# Altium schematic sheet ESP32 USBC.SchDoc
size A2; SheetNumber: 1; SheetTotal: 1
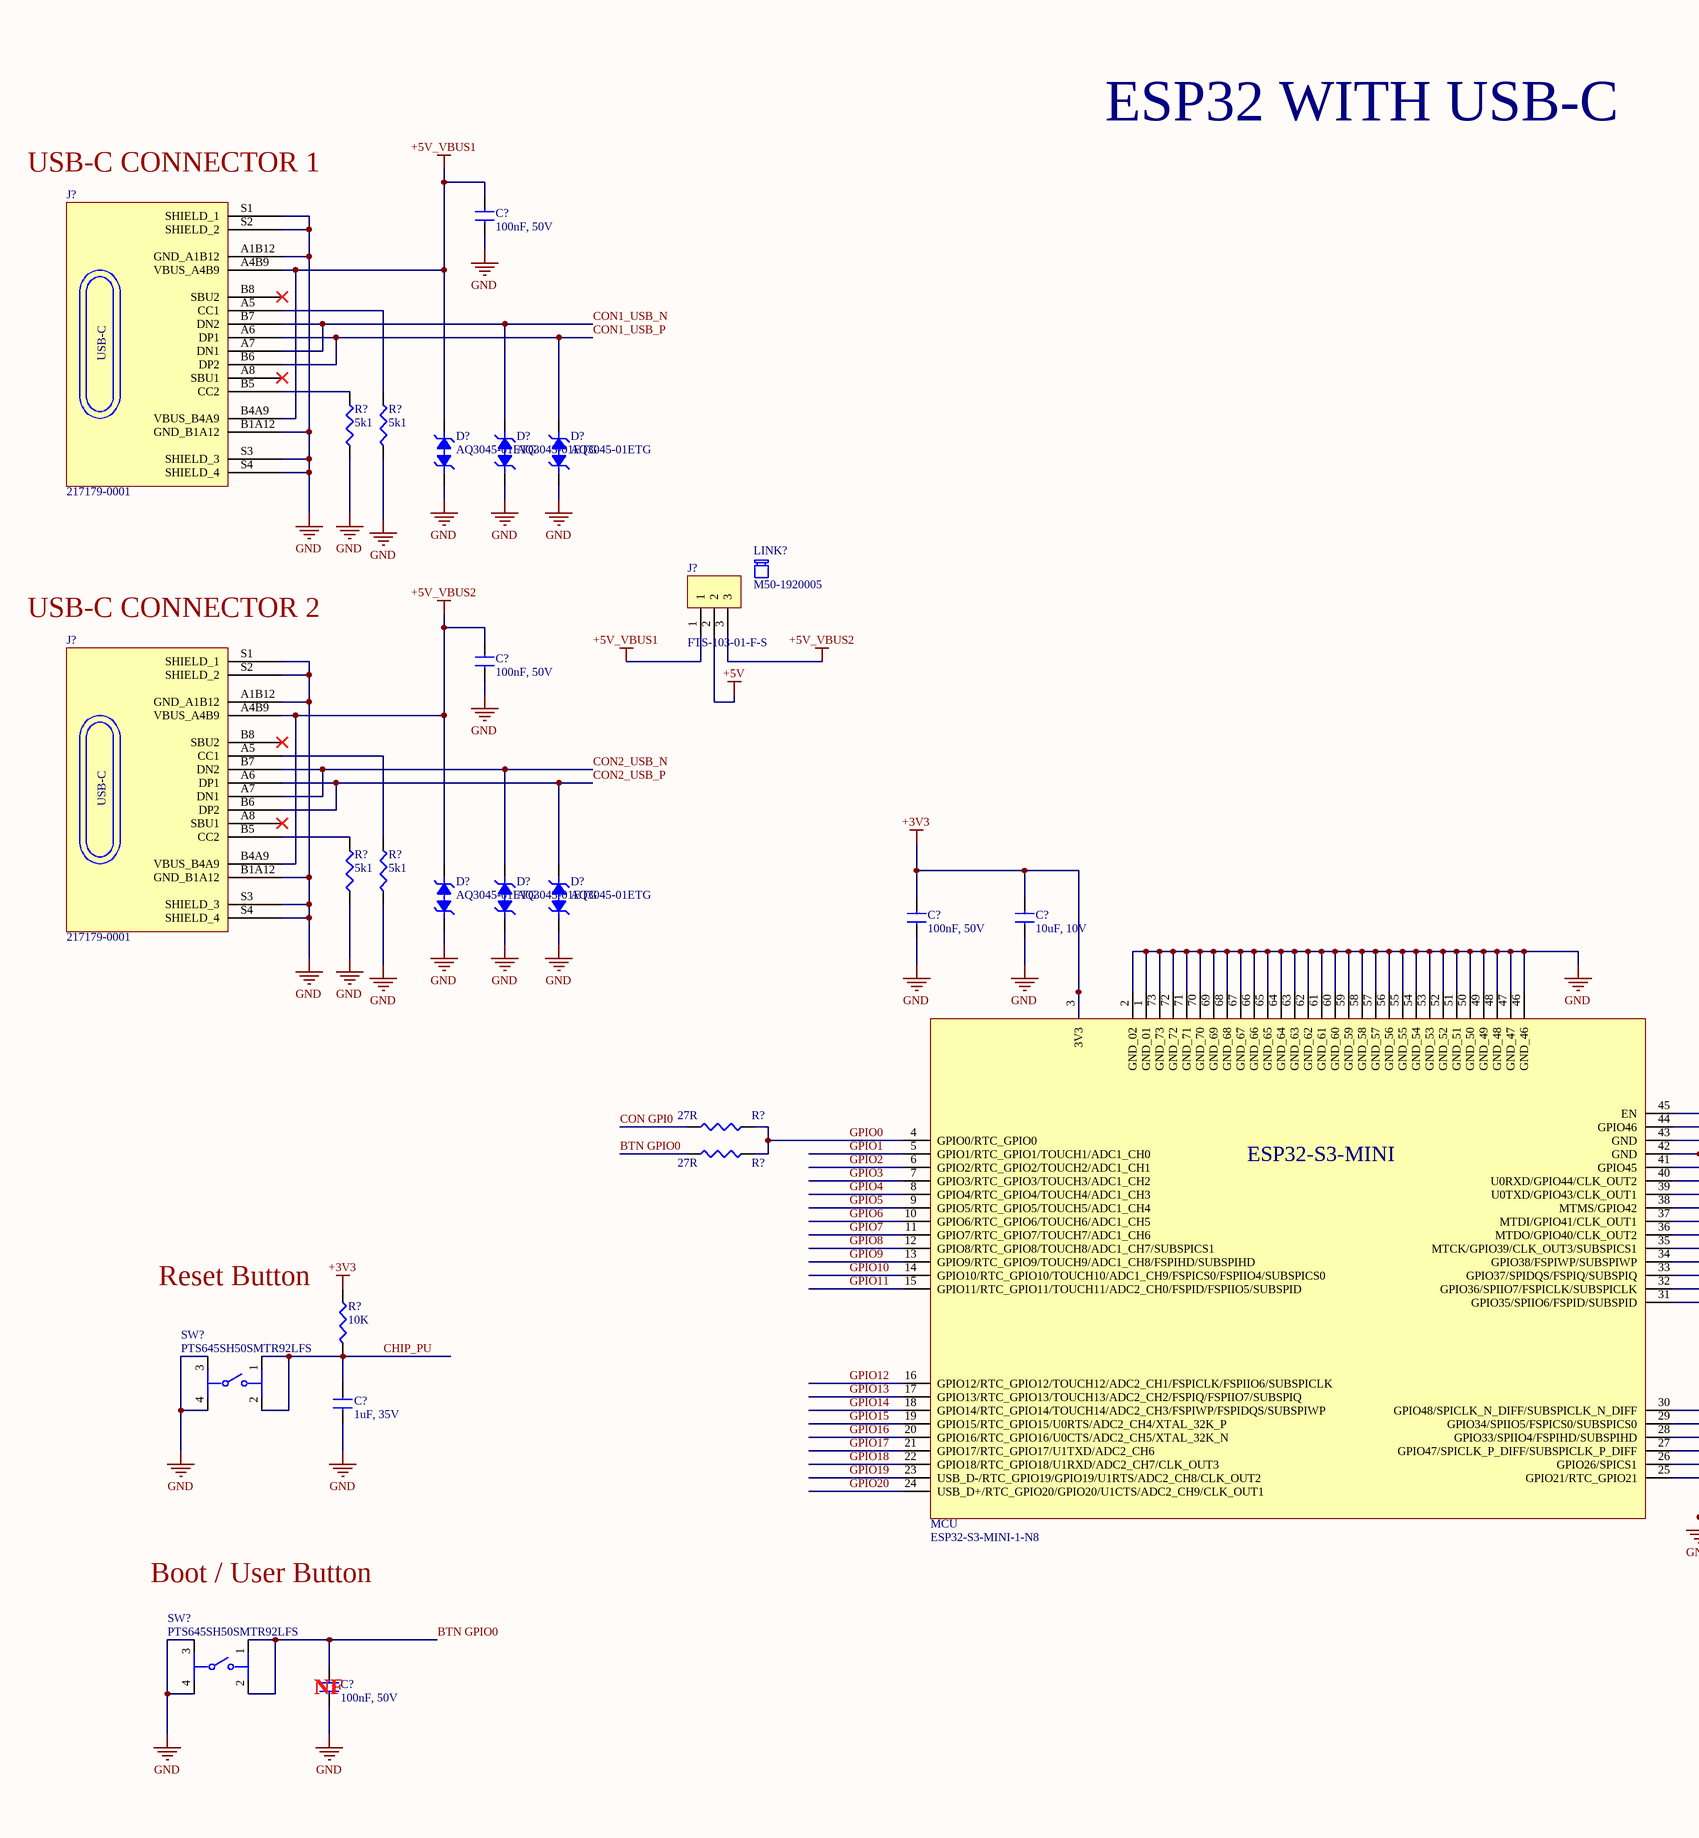
[diagram p0: ESP32 USBC.SchDoc, left]
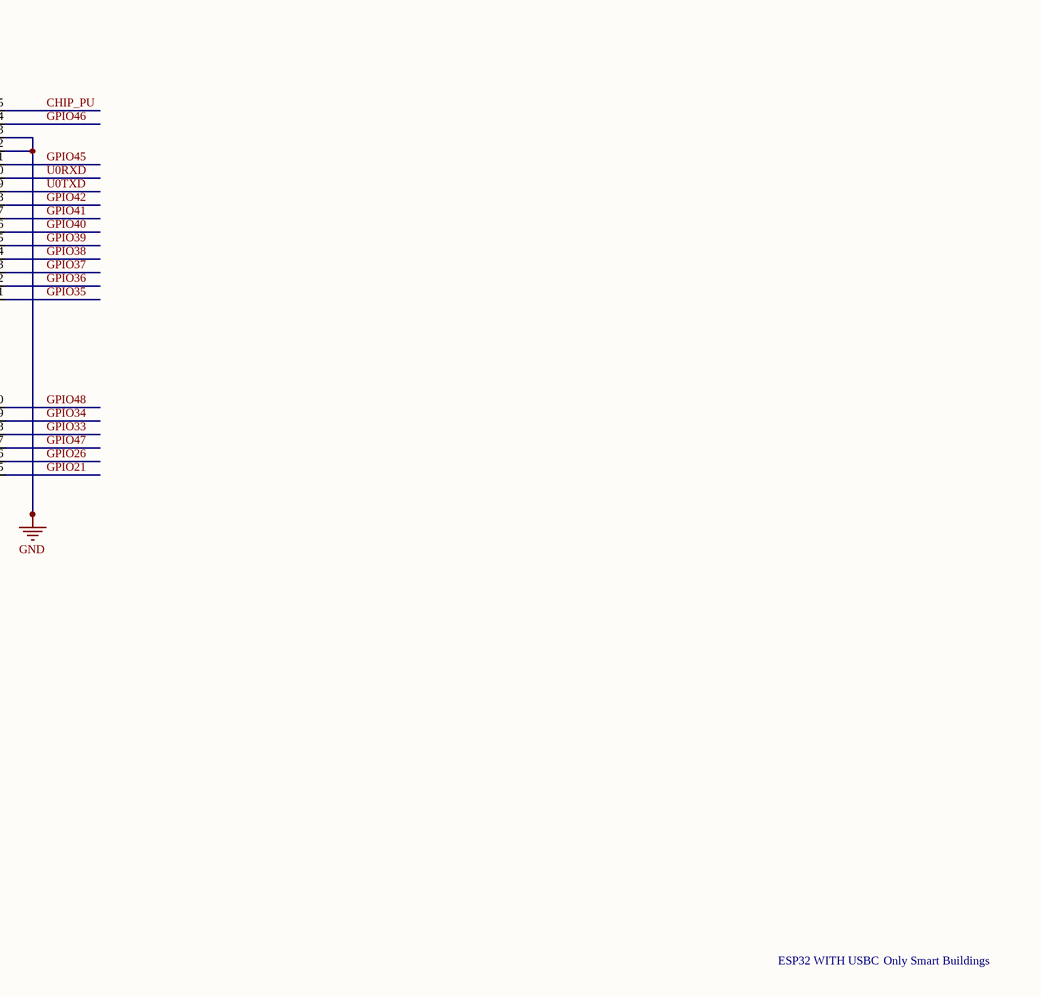
[diagram p1: ESP32 USBC.SchDoc, right]

## Parts
(Parts that share a designator on the sheet are numbered #1, #2 ... from top to bottom, then left to right.)
C?#1  100nF, 50V
C?#2  100nF, 50V
C?#3  100nF, 50V
C?#4  10uF, 10V
C?#5  1uF, 35V
C?#6  100nF, 50V
D?#1  AQ3045-01ETG
D?#2  AQ3045-01ETG
D?#3  AQ3045-01ETG
D?#4  AQ3045-01ETG
D?#5  AQ3045-01ETG
D?#6  AQ3045-01ETG
J?#1  217179-0001
J?#2  FTS-103-01-F-S
J?#3  217179-0001
LINK?  M50-1920005
MCU  ESP32-S3-MINI-1-N8
R?#1  5k1
R?#2  5k1
R?#3  5k1
R?#4  5k1
R?#5  27R
R?#6  27R
R?#7  10K
SW?#1  PTS645SH50SMTR92LFS
SW?#2  PTS645SH50SMTR92LFS

## Nets
+3V3: C?#3.2 C?#4.2 MCU.3(3V3) R?#7.1
+5V: J?#2.2
+5V_VBUS1: C?#1.2 D?#1.2 J?#1.A4B9(VBUS_A4B9) J?#1.B4A9(VBUS_B4A9) J?#2.1
+5V_VBUS2: C?#2.2 D?#4.2 J?#2.3 J?#3.A4B9(VBUS_A4B9) J?#3.B4A9(VBUS_B4A9)
GND: C?#1.1 C?#2.1 C?#3.1 C?#4.1 C?#5.1 C?#6.1 D?#1.1 D?#2.1 D?#3.1 D?#4.1 D?#5.1 D?#6.1 J?#1.A1B12(GND_A1B12) J?#1.B1A12(GND_B1A12) J?#1.S1(SHIELD_1) J?#1.S2(SHIELD_2) J?#1.S3(SHIELD_3) J?#1.S4(SHIELD_4) J?#3.A1B12(GND_A1B12) J?#3.B1A12(GND_B1A12) J?#3.S1(SHIELD_1) J?#3.S2(SHIELD_2) J?#3.S3(SHIELD_3) J?#3.S4(SHIELD_4) MCU.1(GND_01) MCU.2(GND_02) MCU.42(GND) MCU.43(GND) MCU.46(GND_46) MCU.47(GND_47) MCU.48(GND_48) MCU.49(GND_49) MCU.50(GND_50) MCU.51(GND_51) MCU.52(GND_52) MCU.53(GND_53) MCU.54(GND_54) MCU.55(GND_55) MCU.56(GND_56) MCU.57(GND_57) MCU.58(GND_58) MCU.59(GND_59) MCU.60(GND_60) MCU.61(GND_61) MCU.62(GND_62) MCU.63(GND_63) MCU.64(GND_64) MCU.65(GND_65) MCU.66(GND_66) MCU.67(GND_67) MCU.68(GND_68) MCU.69(GND_69) MCU.70(GND_70) MCU.71(GND_71) MCU.72(GND_72) MCU.73(GND_73) R?#1.2 R?#2.1 R?#3.2 R?#4.1 SW?#1.3 SW?#1.4 SW?#2.3 SW?#2.4
BTN GPIO0: C?#6.2 R?#6.1 SW?#2.1 SW?#2.2
CHIP_PU: C?#5.2 MCU.45(EN) R?#7.2 SW?#1.1 SW?#1.2
CON1_USB_N: D?#2.2 J?#1.A7(DN1) J?#1.B7(DN2)
CON1_USB_P: D?#3.2 J?#1.A6(DP1) J?#1.B6(DP2)
CON2_USB_N: D?#5.2 J?#3.A7(DN1) J?#3.B7(DN2)
CON2_USB_P: D?#6.2 J?#3.A6(DP1) J?#3.B6(DP2)
CON GPI0: R?#5.1
GPIO0: MCU.4(GPIO0/RTC_GPIO0) R?#5.2 R?#6.2
GPIO1: MCU.5(GPIO1/RTC_GPIO1/TOUCH1/ADC1_CH0)
GPIO2: MCU.6(GPIO2/RTC_GPIO2/TOUCH2/ADC1_CH1)
GPIO3: MCU.7(GPIO3/RTC_GPIO3/TOUCH3/ADC1_CH2)
GPIO4: MCU.8(GPIO4/RTC_GPIO4/TOUCH4/ADC1_CH3)
GPIO5: MCU.9(GPIO5/RTC_GPIO5/TOUCH5/ADC1_CH4)
GPIO6: MCU.10(GPIO6/RTC_GPIO6/TOUCH6/ADC1_CH5)
GPIO7: MCU.11(GPIO7/RTC_GPIO7/TOUCH7/ADC1_CH6)
GPIO8: MCU.12(GPIO8/RTC_GPIO8/TOUCH8/ADC1_CH7/SUBSPICS1)
GPIO9: MCU.13(GPIO9/RTC_GPIO9/TOUCH9/ADC1_CH8/FSPIHD/SUBSPIHD)
GPIO10: MCU.14(GPIO10/RTC_GPIO10/TOUCH10/ADC1_CH9/FSPICS0/FSPIIO4/SUBSPICS0)
GPIO11: MCU.15(GPIO11/RTC_GPIO11/TOUCH11/ADC2_CH0/FSPID/FSPIIO5/SUBSPID)
GPIO12: MCU.16(GPIO12/RTC_GPIO12/TOUCH12/ADC2_CH1/FSPICLK/FSPIIO6/SUBSPICLK)
GPIO13: MCU.17(GPIO13/RTC_GPIO13/TOUCH13/ADC2_CH2/FSPIQ/FSPIIO7/SUBSPIQ)
GPIO14: MCU.18(GPIO14/RTC_GPIO14/TOUCH14/ADC2_CH3/FSPIWP/FSPIDQS/SUBSPIWP)
GPIO15: MCU.19(GPIO15/RTC_GPIO15/U0RTS/ADC2_CH4/XTAL_32K_P)
GPIO16: MCU.20(GPIO16/RTC_GPIO16/U0CTS/ADC2_CH5/XTAL_32K_N)
GPIO17: MCU.21(GPIO17/RTC_GPIO17/U1TXD/ADC2_CH6)
GPIO18: MCU.22(GPIO18/RTC_GPIO18/U1RXD/ADC2_CH7/CLK_OUT3)
GPIO19: MCU.23(USB_D-/RTC_GPIO19/GPIO19/U1RTS/ADC2_CH8/CLK_OUT2)
GPIO20: MCU.24(USB_D+/RTC_GPIO20/GPIO20/U1CTS/ADC2_CH9/CLK_OUT1)
GPIO21: MCU.25(GPIO21/RTC_GPIO21)
GPIO26: MCU.26(GPIO26/SPICS1)
GPIO33: MCU.28(GPIO33/SPIIO4/FSPIHD/SUBSPIHD)
GPIO34: MCU.29(GPIO34/SPIIO5/FSPICS0/SUBSPICS0)
GPIO35: MCU.31(GPIO35/SPIIO6/FSPID/SUBSPID)
GPIO36: MCU.32(GPIO36/SPIIO7/FSPICLK/SUBSPICLK)
GPIO37: MCU.33(GPIO37/SPIDQS/FSPIQ/SUBSPIQ)
GPIO38: MCU.34(GPIO38/FSPIWP/SUBSPIWP)
GPIO39: MCU.35(MTCK/GPIO39/CLK_OUT3/SUBSPICS1)
GPIO40: MCU.36(MTDO/GPIO40/CLK_OUT2)
GPIO41: MCU.37(MTDI/GPIO41/CLK_OUT1)
GPIO42: MCU.38(MTMS/GPIO42)
GPIO45: MCU.41(GPIO45)
GPIO46: MCU.44(GPIO46)
GPIO47: MCU.27(GPIO47/SPICLK_P_DIFF/SUBSPICLK_P_DIFF)
GPIO48: MCU.30(GPIO48/SPICLK_N_DIFF/SUBSPICLK_N_DIFF)
U0RXD: MCU.40(U0RXD/GPIO44/CLK_OUT2)
U0TXD: MCU.39(U0TXD/GPIO43/CLK_OUT1)
NetJ?#1_A5: J?#1.A5(CC1) R?#1.1
NetJ?#1_B5: J?#1.B5(CC2) R?#2.2
NetJ?#3_A5: J?#3.A5(CC1) R?#3.1
NetJ?#3_B5: J?#3.B5(CC2) R?#4.2

Not connected (* = marked no-connect by the designer): J?#1 A8(SBU1)* B8(SBU2)*; J?#3 A8(SBU1)* B8(SBU2)*

## Notes on the sheet
- ESP32 WITH USB-C
- (near J?#1) USB-C CONNECTOR 1
- (near J?#3) USB-C CONNECTOR 2
- (near R?#7) Reset Button
- Boot / User Button
- (near C?#6) NF
- ESP32 WITH USBC
- Only Smart Buildings
- (in symbol 217179-0001) USB-C
- (in symbol ESP32-S3-MINI-1-N8) ESP32-S3-MINI

## Library data of the parts
C?#1-C?#3 C?#6 = CL05B104KB54PNC: CAP CER 0.1UF 50V X7R 0402; Manufacturer: Samsung; Material: 4241ConductorMaterial; Tolerance: 10%; Supplier: Digikey; Supplier Part Number: 1276-CL05B104KB54PNCDKR-ND; Manufacturer Part Number: CL05B104KB54PNC; RoHS: Yes; Category: Ceramic Capacitors; Stock: 1470482; Pricing: 1=0,1, 10=0,036, 50=0,0246, 100=0,021, 500=0,01498, 1000=0,01311, 2500=0,01114, 5000=0,00995 (USD); Case/Package: 343Case; Min Operating Temperature: -55°C; Max Operating Temperature: 125°C; Voltage Rating: 50V; Value: 100nF; Height: 550um; RoHS Compliant: Yes; LCSC Part Number: C307331
C?#4 = CL05A106MP5NUNC: CAP CER 10UF 10V X5R 0402; Manufacturer: Samsung; Material: 4241ConductorMaterial; Tolerance: 20%; Supplier: Digikey; Supplier Part Number: 1276-1450-1-ND; Manufacturer Part Number: CL05A106MP5NUNC; RoHS: Yes; Category: Ceramic Capacitors; Stock: 762217; Pricing: 1=0,12, 10=0,069, 100=0,0438, 1000=0,03024, 2500=0,02666, 5000=0,02442 (USD); Mounting Technology: Surface Mount; Case/Package: 0402; Case Code (Metric): 1005; Case Code (Imperial): 0402; Min Operating Temperature: -55°C; Max Operating Temperature: 85°C; Package Quantity: 1; Packaging: Tape and Reel; Value: 10uF; Voltage Rating: 10V; Dielectric: X5R; Series: CL; Voltage Rating (DC): 10V; Length: 1mm; Width: 0.02inch; Thickness: 0.028inch; Depth: 0.5mm; Radiation Hardening: No; Lead Free: Lead Free; RoHS Compliant: Yes; ComponentLink1URL: https://datasheet.ciiva.com/25721/cl05a106mp5nunc-25721584.pdf?src-supplier=Digikey; ComponentLink1Description: https://datasheet.ciiva.com/25721/cl05a106mp5nunc-25721584.pdf?src-supplier=Digikey; ComponentLink2URL: https://datasheet.ciiva.com/26838/getdatasheetpartid-745310-26838170.pdf?src-supplier=Verical; ComponentLink2Description: https://datasheet.ciiva.com/26838/getdatasheetpartid-745310-26838170.pdf?src-supplier=Verical; LCSC Part Number: C315248
C?#5 = CL05A105KL5NRNC: CAP CER 1UF 35V X5R 0402; Manufacturer: Samsung; Material: 4241ConductorMaterial; Tolerance: 10%; Supplier: Digikey; Supplier Part Number: 1276-6796-1-ND; Manufacturer Part Number: CL05A105KL5NRNC; RoHS: Yes; Category: Ceramic Capacitors; Stock: 199032; Pricing: 1=0,31, 10=0,182, 50=0,13, 100=0,114, 500=0,08684, 1000=0,07837, 2500=0,06938, 5000=0,06393 (USD); Mounting Technology: Surface Mount; Case/Package: 0402; Case Code (Metric): 1005; Case Code (Imperial): 0402; Min Operating Temperature: -55°C; Max Operating Temperature: 85°C; Packaging: Cut Tape; Value: 1uF; Voltage Rating: 35V; Series: CL; Length: 0.039inch; Width: 0.02inch; Height: 550um; Thickness: 0.022inch; RoHS Compliant: Yes; ComponentLink1URL: http://www.samsungsem.com/kr/support/product-search/mlcc/CL05A105KL5NRNC.jsp?src-supplier=Digikey; ComponentLink1Description: http://www.samsungsem.com/kr/support/product-search/mlcc/CL05A105KL5NRNC.jsp?src-supplier=Digikey; LCSC Part Number: C307413
D?#1-D?#6 = AQ3045-01ETG: TVS DIODE 5.3VWM 12VC SOD882; Manufacturer: Littelfuse; Number of Bidirectional Channels: 1; Reverse Standoff Voltage: 5.3V; Min Breakdown Voltage: 6.8V; Peak Pulse Current: 3A; Peak Pulse Power: 40W; Power Line Protection: No; Diode Type: ZENER; Leakage Current: 100nA; Number of Channels: 1NUMBER; Supplier: Digikey; Supplier Part Number: F9321CT-ND; Manufacturer Part Number: AQ3045-01ETG; RoHS: Yes; Category: TVS Diodes; Stock: 16662; Pricing: 1=0,47, 10=0,312, 100=0,152, 500=0,1405, 1000=0,129, 2000=0,127, 5000=0,125 (USD); Mounting Technology: Surface Mount; Min Operating Temperature: -55°C; Max Operating Temperature: 150°C; Packaging: Cut Tape; Series: Automotive, AEC-Q101, AQ3045, SPA®; Operating Supply Voltage: 5.3V; RoHS Compliant: Yes; ComponentLink1URL: https://www.littelfuse.com/~/media/electronics/datasheets/tvs_diode_arrays/littelfuse_tvs_diode_array_aq3045_datasheet.pdf.pdf?src-supplier=Digikey; ComponentLink1Description: https://www.littelfuse.com/~/media/electronics/datasheets/tvs_diode_arrays/littelfuse_tvs_diode_array_aq3045_datasheet.pdf.pdf?src-supplier=Digikey; ComponentLink2URL: http://www.littelfuse.com/~/media/electronics/datasheets/tvs_diode_arrays/littelfuse_tvs_diode_array_aq3045_datasheet.pdf.pdf?src-supplier=Digikey; ComponentLink2Description: http://www.littelfuse.com/~/media/electronics/datasheets/tvs_diode_arrays/littelfuse_tvs_diode_array_aq3045_datasheet.pdf.pdf?src-supplier=Digikey; LCSC Part Number: C3710326
J?#1 J?#3 = 217179-0001: CONN RCP USB2.0 TYP C 24P SMD RA; Manufacturer: Molex; Current Rating: 1.25A; Gender: Receptacle; Number of Contacts: 16; Voltage Rating: 30V; Supplier: Digikey; Supplier Part Number: 900-2171790001CT-ND; Manufacturer Part Number: 217179-0001; RoHS: No; Category: Connectors; Stock: 8297; Pricing: 1=0,79, 10=0,645, 25=0,5948, 50=0,5594, 100=0,5259, 250=0,48484, 500=0,45592 (USD); Contact Material: Nickel,Gold; Min Operating Temperature: -40°C; Max Operating Temperature: 85°C; USB Standard: USB 2.0; Height: 3.36mm; LCSC Part Number: C3197684
J?#2 = FTS-103-01-F-S: CONN HEADER VERT 3POS 1.27MM; Manufacturer: Samtec; Supplier: Digikey; Supplier Part Number: 612-FTS-103-01-F-S-ND; Manufacturer Part Number: FTS-103-01-F-S; RoHS: Yes; Category: Connectors; Stock: 2501; Pricing: 1=0,73, 50=0,6378, 100=0,5407, 500=0,4491, 1000=0,4 (USD); ComponentLink1URL: http://www.samtec.com/documents/webfiles/pdf/FTS.pdf?src-supplier=Avnet; ComponentLink1Description: http://www.samtec.com/documents/webfiles/pdf/FTS.pdf?src-supplier=Avnet; ComponentLink2URL: http://suddendocs.samtec.com/prints/fts-1xx-xx-xx-xx-xx-mkt.pdf?src-supplier=Digikey; ComponentLink2Description: http://suddendocs.samtec.com/prints/fts-1xx-xx-xx-xx-xx-mkt.pdf?src-supplier=Digikey; ComponentLink3URL: https://datasheet.octopart.com/FTS-103-01-F-S-Samtec-datasheet-116535195.pdf?src-supplier=Toby+Electronics; ComponentLink3Description: https://datasheet.octopart.com/FTS-103-01-F-S-Samtec-datasheet-116535195.pdf?src-supplier=Toby+Electronics; ComponentLink4URL: https://datasheet.octopart.com/FTS-103-01-F-S-Samtec-datasheet-151470456.pdf?src-supplier=Sager+Electronics; ComponentLink4Description: https://datasheet.octopart.com/FTS-103-01-F-S-Samtec-datasheet-151470456.pdf?src-supplier=Sager+Electronics; LCSC Part Number: C3333578
LINK? = M50-1920005: CONN SHUNT 1.27MM RED; Manufacturer: Harwin; Supplier: Digikey; Supplier Part Number: 952-1727-ND; Manufacturer Part Number: M50-1920005; RoHS: Yes; Category: Headers and Wire Housings; Stock: 2029; Pricing: 1=0,33, 10=0,273, 25=0,2512, 50=0,2362, 100=0,222, 250=0,20468, 500=0,19246, 1000=0,18098, 3000=0,16418 (USD); ComponentLink1URL: https://datasheet.ciiva.com/4573/m50-19x-350826-4573042.pdf?src-supplier=Mouser; ComponentLink1Description: https://datasheet.ciiva.com/4573/m50-19x-350826-4573042.pdf?src-supplier=Mouser; ComponentLink2URL: https://datasheet.ciiva.com/767/m50-19x-767921.pdf?src-supplier=Digikey; ComponentLink2Description: https://datasheet.ciiva.com/767/m50-19x-767921.pdf?src-supplier=Digikey; ComponentLink3URL: https://datasheet.ciiva.com/1456/m50-19x-1456640.pdf?src-supplier=Newark; ComponentLink3Description: https://datasheet.ciiva.com/1456/m50-19x-1456640.pdf?src-supplier=Newark; ComponentLink4URL: https://datasheet.ciiva.com/1412/1836978-1412125.pdf?src-supplier=Element14; ComponentLink4Description: https://datasheet.ciiva.com/1412/1836978-1412125.pdf?src-supplier=Element14; LCSC Part Number: C6985646
MCU = ESP32-S3-MINI-1-N8: SMD module, ESP32-S3FN8, 8 MB SPI flash, PCB antenna; Manufacturer: Espressif Systems; Supplier: Digikey; Supplier Part Number: 1965-ESP32-S3-MINI-1-N8CT-ND; Manufacturer Part Number: ESP32-S3-MINI-1-N8; RoHS: No; Category: LDO; Stock: 6321; Pricing: 1=3,1 (USD); ComponentLink1URL: https://datasheet.octopart.com/ESP32-S3-MINI-1-N8-Espressif-Systems-datasheet-165560562.pdf?src-supplier=TME; ComponentLink1Description: https://datasheet.octopart.com/ESP32-S3-MINI-1-N8-Espressif-Systems-datasheet-165560562.pdf?src-supplier=TME; LCSC Part Number: C2913206
R?#1-R?#4 = AC0402FR-075K1L: RES SMD 5.1K OHM 1% 1/16W 0402; Manufacturer: Yageo; Value: 5.1kR; Power Rating: 63mW; Temperature Coefficient: 100ppm/°C; Voltage Rating: 50V; Supplier: Digikey; Supplier Part Number: YAG3503CT-ND; Manufacturer Part Number: AC0402FR-075K1L; RoHS: Yes; Category: Chip SMD Resistors; Stock: 45920; Pricing: 1=0,1, 10=0,009, 100=0,0082, 1000=0,00714, 2500=0,00612, 5000=0,0051 (USD); Mounting Technology: Surface Mount; Case/Package: 0402; Case Code (Metric): 1005; Case Code (Imperial): 0402; Min Operating Temperature: -55°C; Max Operating Temperature: 155°C; Tolerance: 1%; Packaging: Cut Tape; Number of Terminations: 2; Max Power Dissipation: 63mW; Features: Moisture Resistant,Automotive AEC-Q200; Series: AC; Length: 0.039inch; Width: 0.02inch; Height: 0.015inch; RoHS Compliant: Yes; Lead Free: 5697LeadFree; ComponentLink1URL: https://datasheet.octopart.com/AC0402FR-075K1L-Yageo-datasheet-166720450.pdf?src-supplier=Future+Electronics; ComponentLink1Description: https://datasheet.octopart.com/AC0402FR-075K1L-Yageo-datasheet-166720450.pdf?src-supplier=Future+Electronics; ComponentLink2URL: http://www.yageo.com/NewPortal/yageodocoutput?fileName=/pdf/R-Chip/PYu-AC_51_RoHS_L_6.pdf&src-supplier=Digikey; ComponentLink2Description: http://www.yageo.com/NewPortal/yageodocoutput?fileName=/pdf/R-Chip/PYu-AC_51_RoHS_L_6.pdf&src-supplier=Digikey; ComponentLink3URL: http://www.yageo.com/documents/recent/PYu-AC_51_RoHS_L_2_revised.pdf?src-supplier=Future+Electronics; ComponentLink3Description: http://www.yageo.com/documents/recent/PYu-AC_51_RoHS_L_2_revised.pdf?src-supplier=Future+Electronics; LCSC Part Number: C144745
R?#5 R?#6 = RC0402JR-0727RL: RES 27 OHM 5% 1/16W 0402; Manufacturer: Yageo; Voltage Rating (AC): 50V; Supplier: Digikey; Supplier Part Number: 311-27JRCT-ND; Manufacturer Part Number: RC0402JR-0727RL; RoHS: Yes; Category: Chip SMD Resistors; Stock: 1385185; Pricing: 1=0,1, 10=0,009, 50=0,0076, 100=0,0061, 500=0,0056, 1000=0,0051, 5000=0,00408 (USD); Lead Free: 5697LeadFree; RoHS Compliant: 5897YesNo; ComponentLink1URL: https://datasheet.ciiva.com/7850/1018594-7850188.pdf?src-supplier=Element14; ComponentLink1Description: https://datasheet.ciiva.com/7850/1018594-7850188.pdf?src-supplier=Element14; ComponentLink2URL: https://datasheet.ciiva.com/7850/1018594-7850189.pdf?src-supplier=Element14; ComponentLink2Description: https://datasheet.ciiva.com/7850/1018594-7850189.pdf?src-supplier=Element14; ComponentLink3URL: https://datasheet.ciiva.com/12577/pyu-rc0402-51-rohs-l-6-r-12577469.pdf?src-supplier=Mouser; ComponentLink3Description: https://datasheet.ciiva.com/12577/pyu-rc0402-51-rohs-l-6-r-12577469.pdf?src-supplier=Mouser; ComponentLink4URL: https://datasheet.ciiva.com/16741/pyu-rc0402-51-rohs-l-6-r-16741391.pdf?src-supplier=Future+Electronics; ComponentLink4Description: https://datasheet.ciiva.com/16741/pyu-rc0402-51-rohs-l-6-r-16741391.pdf?src-supplier=Future+Electronics; LCSC Part Number: C137890
R?#7 = AC0402FR-0710KL: RES SMD 10K OHM 1% 1/16W 0402; Manufacturer: Yageo; Value: 10kR; Power Rating: 62.5mW; Voltage Rating: 50V; Temperature Coefficient: 100ppm/°C; Max Power Dissipation: 63mW; Supplier: Digikey; Supplier Part Number: YAG3436CT-ND; Manufacturer Part Number: AC0402FR-0710KL; RoHS: Yes; Category: Chip SMD Resistors; Stock: 897257; Pricing: 1=0,1, 10=0,01, 50=0,0086, 100=0,0071, 500=0,00612, 1000=0,0051, 5000=0,00408 (USD); Case/Package: 0402; Case Code (Imperial): 0402; Case Code (Metric): 1005; Min Operating Temperature: -55°C; Max Operating Temperature: 155°C; Tolerance: 1%; Packaging: Tape and Reel; Termination: SMD/SMT; Number of Terminations: 2; Features: Moisture Resistant,Automotive AEC-Q200; Series: AC; Length: 0.039inch; Width: 0.02inch; Height: 0.015inch; Lead Free: Lead Free; RoHS Compliant: Yes; ComponentLink1URL: https://datasheet.ciiva.com/12656/pyu-ac-51-rohs-l-2-12656634.pdf?src-supplier=Mouser; ComponentLink1Description: https://datasheet.ciiva.com/12656/pyu-ac-51-rohs-l-2-12656634.pdf?src-supplier=Mouser; LCSC Part Number1: C144807
SW?#1 SW?#2 = PTS645SH50SMTR92LFS: SWITCH TACTILE SPST-NO 0.05A 12V; Manufacturer: ITT C&K; Contact Current Rating: 50mA; Contact Resistance: 100mR; Number of Positions: 2NUMBER; Supplier: Digikey; Supplier Part Number: CKN9085CT-ND; Manufacturer Part Number: PTS645SH50SMTR92LFS; RoHS: Yes; Category: Tactile Switches; Stock: 28508; Pricing: 1=0,4, 10=0,325, 25=0,2992, 100=0,2639, 250=0,24264, 500=0,22758 (USD); Lead Free: 5697LeadFree; ComponentLink1URL: https://datasheet.ciiva.com/29903/getdatasheetpartid-773702-29903807.pdf?src-supplier=Verical; ComponentLink1Description: https://datasheet.ciiva.com/29903/getdatasheetpartid-773702-29903807.pdf?src-supplier=Verical; ComponentLink2URL: https://datasheet.ciiva.com/14920/pts645-14920741.pdf?src-supplier=Digikey; ComponentLink2Description: https://datasheet.ciiva.com/14920/pts645-14920741.pdf?src-supplier=Digikey; ComponentLink3URL: https://datasheet.ciiva.com/22637/1707731-22637356.pdf?src-supplier=Element14; ComponentLink3Description: https://datasheet.ciiva.com/22637/1707731-22637356.pdf?src-supplier=Element14; LCSC Part Number: C221869